# EAGLE schematic mLRS-rx-board01-v013 (EAGLE 7.5.0)
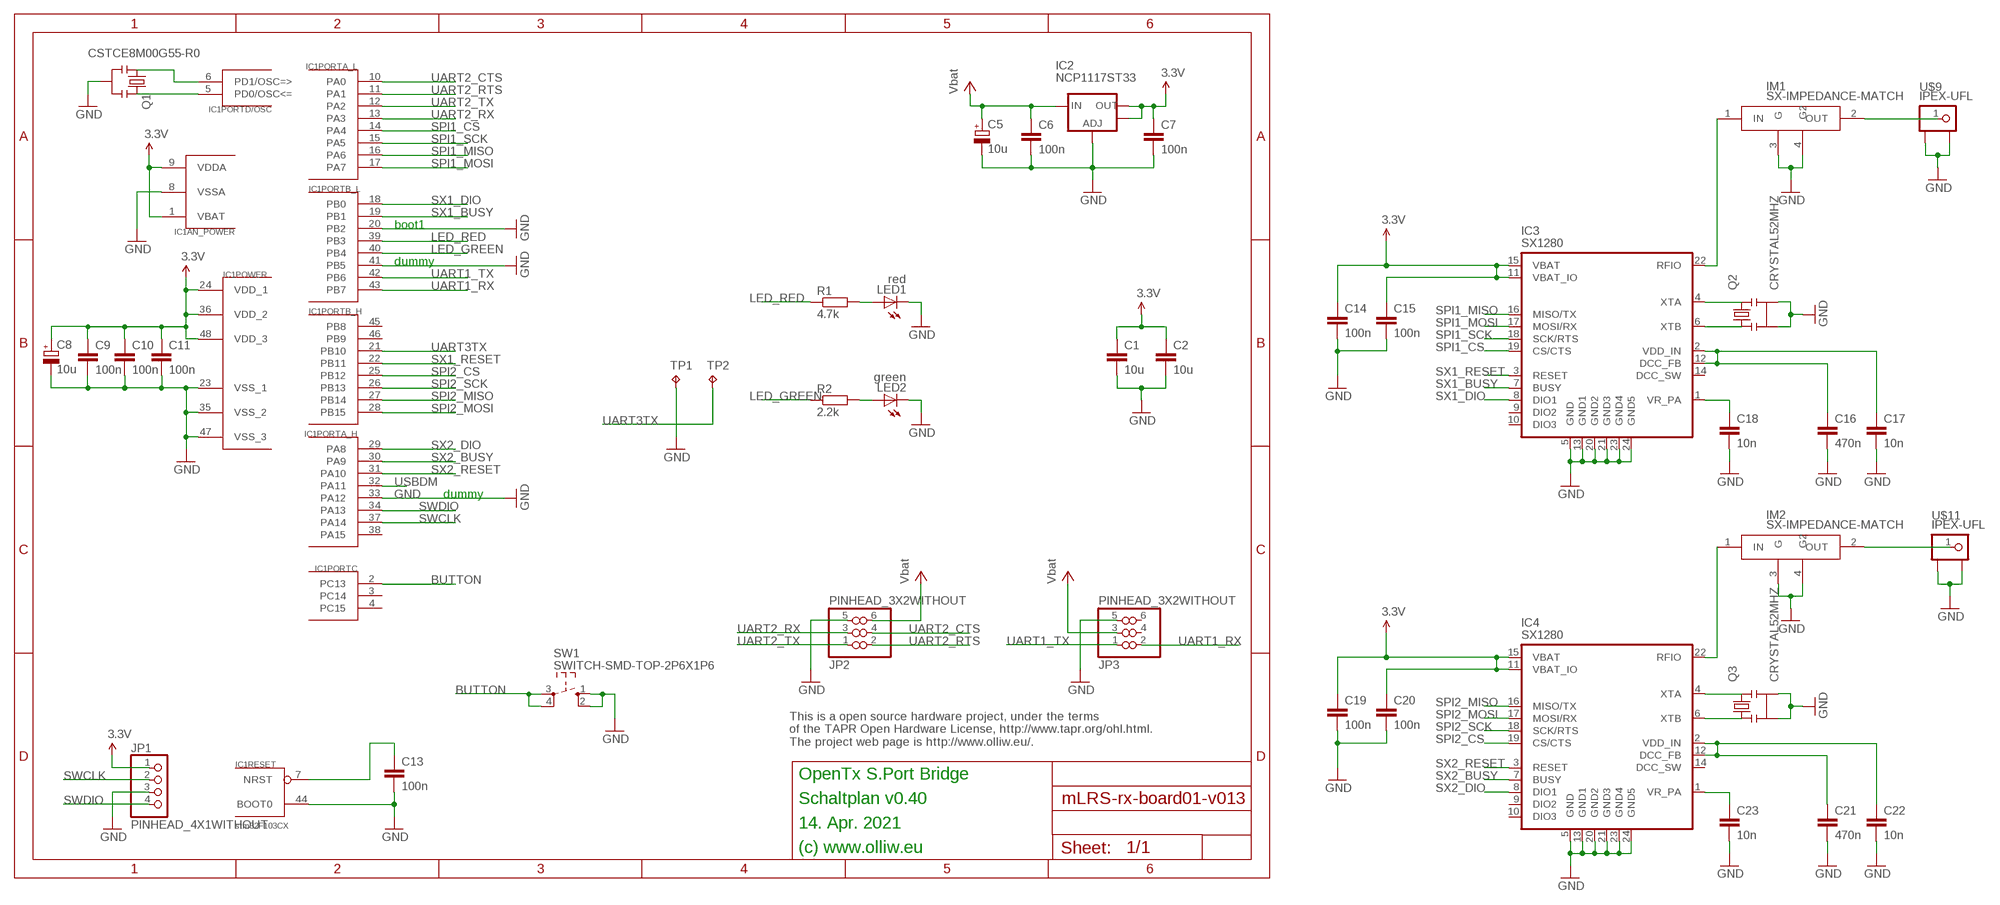
[diagram p0: schematic, sheet 1]

## Parts
C1  10u  C-EUC0603  [C0603]
C2  10u  C-EUC0603  [C0603]
C5  10u  CPOL-EUSMCA  [SMC_A]
C6  100n  C-EUC0603  [C0603]
C7  100n  C-EUC0603  [C0603]
C8  10u  CPOL-EUSMCA  [SMC_A]
C9  100n  C-EUC0603  [C0603]
C10  100n  C-EUC0603  [C0603]
C11  100n  C-EUC0603  [C0603]
C13  100n  C-EUC0603  [C0603]
C14  100n  C-EUC0402  [C0402]
C15  100n  C-EUC0402  [C0402]
C16  470n  C-EUC0402  [C0402]
C17  10n  C-EUC0402  [C0402]
C18  10n  C-EUC0402  [C0402]
C19  100n  C-EUC0402  [C0402]
C20  100n  C-EUC0402  [C0402]
C21  470n  C-EUC0402  [C0402]
C22  10n  C-EUC0402  [C0402]
C23  10n  C-EUC0402  [C0402]
IC1  stm32F103CX  STM32F10XCXT6  [TQFP48]
IC2  NCP1117ST33  V_REG_LM1117SOT223  [SOT223]
IC3  SX1280  [QFN24-4X4-SX128X]
IC4  SX1280  [QFN24-4X4-SX128X]
IM1  SX-IMPEDANCE-MATCH  [SX-IMPEDANCE-MATCH]
IM2  SX-IMPEDANCE-MATCH  [SX-IMPEDANCE-MATCH]
JP1  PINHEAD_4X1WITHOUT  [PINHEAD_4X1_WO]
JP2  PINHEAD_3X2WITHOUT  [PINHEAD_3X2_WO]
JP3  PINHEAD_3X2WITHOUT  [PINHEAD_3X2_WO]
LED1  red  LEDCHIPLED_0603  [CHIPLED_0603]
LED2  green  LEDCHIPLED_0603  [CHIPLED_0603]
Q1  CSTCE8M00G55-R0  RESONATORSMD  [RESONATOR-SMD]
Q2  CRYSTAL52MHZ  [CRYSTAL-SMD-2X1P6-GND]
Q3  CRYSTAL52MHZ  [CRYSTAL-SMD-2X1P6-GND]
R1  4.7k  R-EU_R0402  [R0402]
R2  2.2k  R-EU_R0402  [R0402]
SW1  SWITCH-SMD-TOP-2P6X1P6  [TACTILE-SWITCH-SMD-TOP-2P6X1X6]
TP1  TPB1,27  [B1,27]
TP2  TPB1,27  [B1,27]
U$9  IPEX-UFL  [IPEX-UFL-SMD]
U$11  IPEX-UFL  [IPEX-UFL-SMD]

## Nets
3.3V: C1.1 C2.1 C7.1 C8.+ C9.1 C10.1 C11.1 C14.1 C15.1 C19.1 C20.1 IC1.1(AN_POWER:VBAT) IC1.9(AN_POWER:VDDA) IC1.24(POWER:VDD_1) IC1.36(POWER:VDD_2) IC1.48(POWER:VDD_3) IC2.2(OUT) IC2.4(OUT) IC3.11(VBAT_IO) IC3.15(VBAT) IC4.11(VBAT_IO) IC4.15(VBAT) JP1.1
BUTTON: IC1.2(PORTC:PC13) SW1.3 SW1.4
GND: C1.2 C2.2 C5.- C6.2 C7.2 C8.- C9.2 C10.2 C11.2 C13.2 C14.2 C15.2 C16.2 C17.2 C18.2 C19.2 C20.2 C21.2 C22.2 C23.2 IC1.8(AN_POWER:VSSA) IC1.20(PORTB_L:PB2) IC1.23(POWER:VSS_1) IC1.33(PORTA_H:PA12) IC1.35(POWER:VSS_2) IC1.41(PORTB_L:PB5) IC1.44(RESET:BOOT0) IC1.47(POWER:VSS_3) IC2.1(ADJ) IC3.5(GND) IC3.13(GND1) IC3.20(GND2) IC3.21(GND3) IC3.23(GND4) IC3.24(GND5) IC4.5(GND) IC4.13(GND1) IC4.20(GND2) IC4.21(GND3) IC4.23(GND4) IC4.24(GND5) IM1.3(G) IM1.4(G2) IM2.3(G) IM2.4(G2) JP1.3 JP2.5 JP3.5 LED1.C LED2.C Q1.2 Q2.2 Q2.4 Q3.2 Q3.4 SW1.1 SW1.2 TP1.TP U$9.2 U$9.3 U$11.2 U$11.3
LED_GREEN: IC1.40(PORTB_L:PB4) R2.1
LED_RED: IC1.39(PORTB_L:PB3) R1.1
N$1: IC4.4(XTA) Q3.3
N$2: C21.1 C22.1 IC4.2(VDD_IN) IC4.12(DCC_FB)
N$3: C23.1 IC4.1(VR_PA)
N$4: IC4.6(XTB) Q3.1
N$5: C13.1 IC1.7(RESET:NRST)
N$6: IC4.22(RFIO) IM2.1(IN)
N$7: C16.1 C17.1 IC3.2(VDD_IN) IC3.12(DCC_FB)
N$10: C18.1 IC3.1(VR_PA)
N$11: IC3.4(XTA) Q2.3
N$12: IC1.5(PORTD/OSC:PD0/OSC<=) Q1.3
N$13: IC3.6(XTB) Q2.1
N$14: IC1.6(PORTD/OSC:PD1/OSC=>) Q1.1
N$15: IC3.22(RFIO) IM1.1(IN)
N$16: IM1.2(OUT) U$9.1
N$17: LED1.A R1.2
N$18: IM2.2(OUT) U$11.1
N$19: LED2.A R2.2
SPI1_CS: IC1.14(PORTA_L:PA4) IC3.19(CS/CTS)
SPI1_MISO: IC1.16(PORTA_L:PA6) IC3.16(MISO/TX)
SPI1_MOSI: IC1.17(PORTA_L:PA7) IC3.17(MOSI/RX)
SPI1_SCK: IC1.15(PORTA_L:PA5) IC3.18(SCK/RTS)
SPI2_CS: IC1.25(PORTB_H:PB12) IC4.19(CS/CTS)
SPI2_MISO: IC1.27(PORTB_H:PB14) IC4.16(MISO/TX)
SPI2_MOSI: IC1.28(PORTB_H:PB15) IC4.17(MOSI/RX)
SPI2_SCK: IC1.26(PORTB_H:PB13) IC4.18(SCK/RTS)
SWCLK: IC1.37(PORTA_H:PA14) JP1.2
SWDIO: IC1.34(PORTA_H:PA13) JP1.4
SX1_BUSY: IC1.19(PORTB_L:PB1) IC3.7(BUSY)
SX1_DIO: IC1.18(PORTB_L:PB0) IC3.8(DIO1)
SX1_RESET: IC1.22(PORTB_H:PB11) IC3.3(RESET)
SX2_BUSY: IC1.30(PORTA_H:PA9) IC4.7(BUSY)
SX2_DIO: IC1.29(PORTA_H:PA8) IC4.8(DIO1)
SX2_RESET: IC1.31(PORTA_H:PA10) IC4.3(RESET)
UART1_RX: IC1.43(PORTB_L:PB7) JP3.2
UART1_TX: IC1.42(PORTB_L:PB6) JP3.1
UART2_CTS: IC1.10(PORTA_L:PA0) JP2.4
UART2_RTS: IC1.11(PORTA_L:PA1) JP2.2
UART2_RX: IC1.13(PORTA_L:PA3) JP2.3
UART2_TX: IC1.12(PORTA_L:PA2) JP2.1
UART3TX: IC1.21(PORTB_H:PB10) TP2.TP
USBDM: IC1.32(PORTA_H:PA11)
VCC: C5.+ C6.1 IC2.3(IN) JP2.6 JP3.3 ; supply symbol labelled Vbat
Unconnected: IC1.3(PORTC:PC14) IC1.4(PORTC:PC15) IC1.38(PORTA_H:PA15) IC1.45(PORTB_H:PB8) IC1.46(PORTB_H:PB9) IC3.9(DIO2) IC3.10(DIO3) IC3.14(DCC_SW) IC4.9(DIO2) IC4.10(DIO3) IC4.14(DCC_SW) JP3.4 JP3.6

## Notes on the sheet
- boot1
- dummy
- dummy
- This is a open source hardware project, under the terms
  of the TAPR Open Hardware License, http://www.tapr.org/ohl.html.
  The project web page is http://www.olliw.eu/.
- OpenTx S.Port Bridge
- Schaltplan v0.40
- 14. Apr. 2021
- (c) www.olliw.eu

## Library data of the parts
C1 C2 C6 C7 C9-C11 C13-C23 = rcl:C-EU: CAPACITOR, European symbol
C5 C8 = rcl:CPOL-EU: POLARIZED CAPACITOR, European symbol
IC1 = # stm32:STM32F10XCXT6: ST STM32F101/103 48pin LQFP
IC2 = # SparkFun2:V_REG_LM1117: Voltage Regulator LM1117 Standard adjustable voltage regulator but in SMD form. Spark Fun Electronics SKU : COM-00595
IC3 IC4 = # stdlib:SX1280
IM1 IM2 = # stdlib:SX-IMPEDANCE-MATCH
JP1 = # stdlib:PINHEAD_4X1
JP2 JP3 = # stdlib:PINHEAD_3X2
LED1 LED2 = led:LED: LED OSRAM: - CHIPLED LG R971, LG N971, LY N971, LG Q971, LY Q971, LO R971, LY R971 LH N974, LH R974 LS Q976, LO Q976, LY Q976 LO Q996 - Hyper CHIPLED LW Q18S LB Q993, LB Q99A, LB R99A - SideLED LS A670, LO A670, LY A670, LG A670, LP A670 LB A673, LV A673, LT A673, LW A673 LH A674 LY A675 LS A676, LA A676, LO A676, LY A676, LW A676 LS A679, LY A679, LG A679 - Hyper Micro SIDELED® LS Y876, LA Y876, LO Y876, LY Y876 LT Y87S - SmartLED LW L88C, LW L88S LB L89C, LB L89S, LG L890 LS L89K, LO L89K, LY L89K LS L896, LA L896, LO L896, LY L896 - TOPLED LS T670, LO T670, LY T670, LG T670, LP T670 LSG T670, LSP T670, LSY T670, LOP T670, LYG T670 LG T671, LOG T671, LSG T671 LB T673, LV T673, LT T673, LW T673 LH T674 LS T676, LA T676, LO T676, LY T676, LB T676, LH T676, LSB T676, LW T676 LB T67C, LV T67C, LT T67C, LS T67K, LO T67K, LY T67K, LW E67C LS E67B, LA E67B, LO E67B, LY E67B, LB E67C, LV E67C, LT E67C LW T67C LS T679, LY T679, LG T679 LS T770, LO T770, LY T770, LG T770, LP T770 LB T773, LV T773, LT T773, LW T773 LH T774 LS E675, LA E675, LY E675, LS T675 LS T776, LA T776, LO T776, LY T776, LB T776 LHGB T686 LT T68C, LB T68C - Hyper Mini TOPLED® LB M676 - Mini TOPLED Santana® LG M470 LS M47K, LO M47K, LY M47K Source: http://www.osram.convergy.de LUXEON: - LUMILED® LXK2-PW12-R00, LXK2-PW12-S00, LXK2-PW14-U00, LXK2-PW14-V00 LXK2-PM12-R00, LXK2-PM12-S00, LXK2-PM14-U00 LXK2-PE12-Q00, LXK2-PE12-R00, LXK2-PE12-S00, LXK2-PE14-T00, LXK2-PE14-U00 LXK2-PB12-K00, LXK2-PB12-L00, LXK2-PB12-M00, LXK2-PB14-N00, LXK2-PB14-P00, LXK2-PB14-Q00 LXK2-PR12-L00, LXK2-PR12-M00, LXK2-PR14-Q00, LXK2-PR14-R00 LXK2-PD12-Q00, LXK2-PD12-R00, LXK2-PD12-S00 LXK2-PH12-R00, LXK2-PH12-S00 LXK2-PL12-P00, LXK2-PL12-Q00, LXK2-PL12-R00 Source: www.luxeon.com KINGBRIGHT: KA-3528ASYC Source: www.kingbright.com
Q1 = # SparkFun2:RESONATOR: Resonator Small SMD resonator. This is the itty bitty 10/20MHz resonators with built in caps. CSTCE10M0G55 and CSTCE20M0V53. Footprint has been reviewed closely but hasn't been tested yet.
Q2 Q3 = # stdlib:CRYSTAL52MHZ
R1 R2 = rcl:R-EU_: RESISTOR, European symbol
SW1 = # stdlib:SWITCH-SMD-TOP-2P6X1P6
TP1 TP2 = testpad:TP: Test pad
U$9 U$11 = # stdlib:IPEX-UFL